# EAGLE schematic IO (EAGLE 6.2)
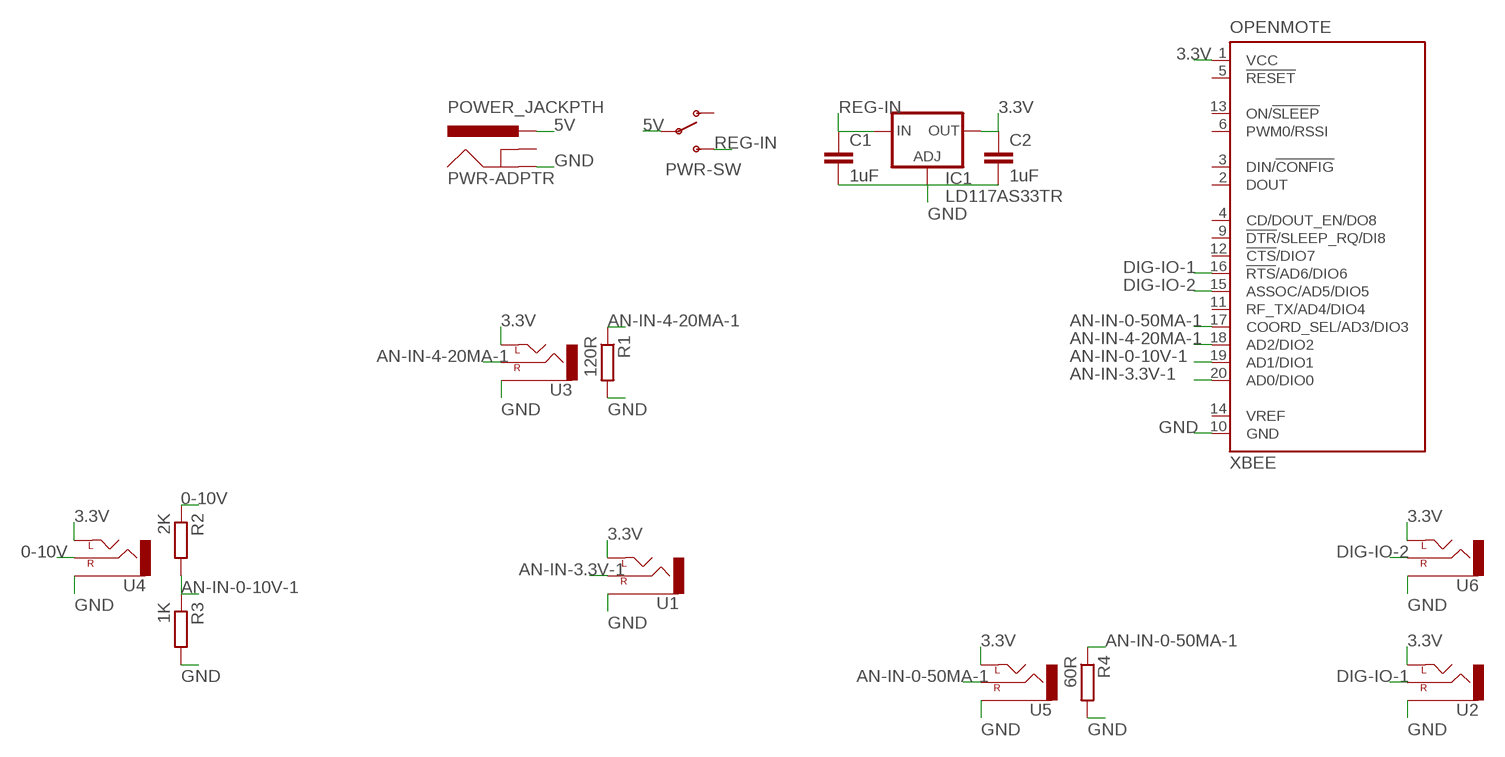
[diagram p0: schematic, sheet 1]

## Parts
C1  1uF  C-EUC0805  [C0805]
C2  1uF  C-EUC0805  [C0805]
IC1  LD117AS33TR  [SOT223]
OPENMOTE  XBEE  [XBEE]
PWR-ADPTR  POWER_JACKPTH  [POWER_JACK_PTH]
PWR-SW  SWITCH-SPDTSMD2  [SWITCH-SPDT-SMD]
R1  120R  R-EU_M0805  [M0805]
R2  2K  R-EU_M0805  [M0805]
R3  1K  R-EU_M0805  [M0805]
R4  60R  R-EU_M0805  [M0805]
U1  AUDIO-JACKSMD2  [AUDIO-JACK-3.5MM-SMD]
U2  AUDIO-JACKSMD2  [AUDIO-JACK-3.5MM-SMD]
U3  AUDIO-JACKSMD2  [AUDIO-JACK-3.5MM-SMD]
U4  AUDIO-JACKSMD2  [AUDIO-JACK-3.5MM-SMD]
U5  AUDIO-JACKSMD2  [AUDIO-JACK-3.5MM-SMD]
U6  AUDIO-JACKSMD2  [AUDIO-JACK-3.5MM-SMD]

## Nets
0-10V: R2.1 U4.RING(RIGHT)
3.3V: C2.1 IC1.4(OUT) OPENMOTE.1(VCC) U1.TIP(LEFT) U2.TIP(LEFT) U3.TIP(LEFT) U4.TIP(LEFT) U5.TIP(LEFT) U6.TIP(LEFT)
5V: PWR-ADPTR.PWR PWR-SW.2(P)
AN-IN-0-10V-1: OPENMOTE.19(AD1/DIO1) R2.2 R3.1
AN-IN-0-50MA-1: OPENMOTE.17(COORD_SEL/AD3/DIO3) R4.1 U5.RING(RIGHT)
AN-IN-3.3V-1: OPENMOTE.20(AD0/DIO0) U1.RING(RIGHT)
AN-IN-4-20MA-1: OPENMOTE.18(AD2/DIO2) R1.1 U3.RING(RIGHT)
DIG-IO-1: OPENMOTE.16(!RTS!/AD6/DIO6) U2.RING(RIGHT)
DIG-IO-2: OPENMOTE.15(ASSOC/AD5/DIO5) U6.RING(RIGHT)
GND: C1.2 C2.2 IC1.1(ADJ) OPENMOTE.10(GND) PWR-ADPTR.GND R1.2 R3.2 R4.2 U1.SLEEVE U2.SLEEVE U3.SLEEVE U4.SLEEVE U5.SLEEVE U6.SLEEVE
REG-IN: C1.1 IC1.3(IN) PWR-SW.3(S)
Unconnected: OPENMOTE.2(DOUT) OPENMOTE.3(DIN/!CONFIG) OPENMOTE.4(CD/DOUT_EN/DO8) OPENMOTE.5(!RESET) OPENMOTE.6(PWM0/RSSI) OPENMOTE.9(!DTR!/SLEEP_RQ/DI8) OPENMOTE.11(RF_TX/AD4/DIO4) OPENMOTE.12(!CTS!/DIO7) OPENMOTE.13(ON/!SLEEP) OPENMOTE.14(VREF) PWR-ADPTR.GNDBREAK PWR-SW.1(O)

## Library data of the parts
C1 C2 = resistor:C-EU: CAPACITOR, European symbol
IC1 = v-reg:LD117A?*: Low drop fixed and adjustable positive voltage regulators 1 A Source: http://www.st.com/stonline/products/literature/ds/7194/ld1117axx.pdf
OPENMOTE = maxstream:XBEE: XBee (TM) /XBee-PRO(TM) OEM RF Modules Source: MaxStream, Inc. xbee_productmanual.pdf; MPN: XBP24-Z7UIT-004; OC_FARNELL: 1751799; OC_NEWARK: 34R5507
PWR-ADPTR = SparkFun-Connectors:POWER_JACK: Power Jack This is the standard 5.5mm barrel jack for power. The PTH is the most common, proven, reliable, footprint. The Slot footprint only works if the mill layer is transmitted to the PCB fab house so be warned. Spark Fun Electronics SKU : PRT-00119 SMT: CONN-08106 Mating wall wart : TOL-00298 (and others)
PWR-SW = SparkFun-Electromechanical:SWITCH-SPDT: SPDT Switch Simple slide switch, Spark Fun Electronics SKU : COM-00102 DPDT SMT slide switch, AYZ0202, SWCH-08179
R1-R4 = resistor:R-EU_: RESISTOR, European symbol
U1-U6 = SparkFun-Connectors:AUDIO-JACK: 3.5mm Audio Jack Simple 3.5mm common PCB mount audio jack. SKU: PRT-08032